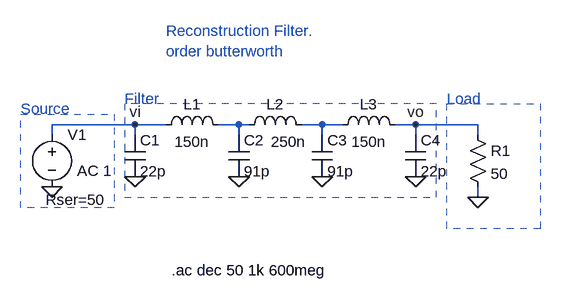
[diagram p0: schematic REC_FILTER.asc]
REC_FILTER.asc, the LTspice schematic file:
Version 4
SHEET 1 880 680
WIRE 16 144 -112 144
WIRE 64 144 16 144
WIRE 176 144 144 144
WIRE 192 144 176 144
WIRE 304 144 272 144
WIRE 336 144 304 144
WIRE 448 144 416 144
WIRE 544 144 448 144
WIRE -112 160 -112 144
WIRE 16 160 16 144
WIRE 176 160 176 144
WIRE 304 160 304 144
WIRE 448 160 448 144
WIRE 544 160 544 144
WIRE 544 256 544 240
FLAG 544 256 0
FLAG 448 224 0
FLAG 304 224 0
FLAG 176 224 0
FLAG 16 224 0
FLAG -112 240 0
FLAG 16 144 vi
FLAG 448 144 vo
SYMBOL ind 48 160 R270
WINDOW 0 32 56 VTop 2
WINDOW 3 5 56 VBottom 2
SYMATTR InstName L1
SYMATTR Value 150n
SYMATTR SpiceLine Rser=1.5
SYMBOL ind 176 160 R270
WINDOW 0 32 56 VTop 2
WINDOW 3 5 76 VBottom 2
SYMATTR InstName L2
SYMATTR Value 250n
SYMATTR SpiceLine Rser=1.4
SYMBOL ind 320 160 R270
WINDOW 0 32 56 VTop 2
WINDOW 3 5 56 VBottom 2
SYMATTR InstName L3
SYMATTR Value 150n
SYMATTR SpiceLine Rpar=1.5
SYMBOL cap 0 160 R0
SYMATTR InstName C1
SYMATTR Value 22p
SYMATTR SpiceLine Rser=8m
SYMBOL cap 160 160 R0
SYMATTR InstName C2
SYMATTR Value 91p
SYMATTR SpiceLine Rser=8m
SYMBOL cap 288 160 R0
SYMATTR InstName C3
SYMATTR Value 91p
SYMATTR SpiceLine Rser=8m
SYMBOL cap 432 160 R0
SYMATTR InstName C4
SYMATTR Value 22p
SYMATTR SpiceLine Lser=8m
SYMBOL res 528 144 R0
SYMATTR InstName R1
SYMATTR Value 50
SYMBOL voltage -112 144 R0
WINDOW 123 39 71 Left 2
WINDOW 39 -10 116 Left 2
SYMATTR InstName V1
SYMATTR Value ""
SYMATTR Value2 AC 1
SYMATTR SpiceLine Rser=50
TEXT 72 368 Left 2 !.ac dec 50 1k 600meg
TEXT 64 0 Left 2 ;Reconstruction Filter.\norder butterworth
TEXT 496 104 Left 2 ;Load
TEXT 0 104 Left 2 ;Filter
TEXT -160 120 Left 2 ;Source
RECTANGLE Normal 640 304 496 112 2
RECTANGLE Normal 0 256 480 112 2
RECTANGLE Normal -16 272 -160 128 2

The netlist it stands for:
* REC_FILTER.asc
L1 vi N001 150n Rser=1.5
L2 N001 N002 250n Rser=1.4
L3 N002 vo 150n Rpar=1.5
C1 vi 0 22p Rser=8m
C2 N001 0 91p Rser=8m
C3 N002 0 91p Rser=8m
C4 vo 0 22p Lser=8m
R1 vo 0 50
V1 vi 0 AC 1 Rser=50
.ac dec 50 1k 600meg
* Reconstruction Filter.
* order butterworth
* Load
* Filter
* Source
.backanno
.end